# EAGLE design RPi RGB Matrix (EAGLE 8.2.2)
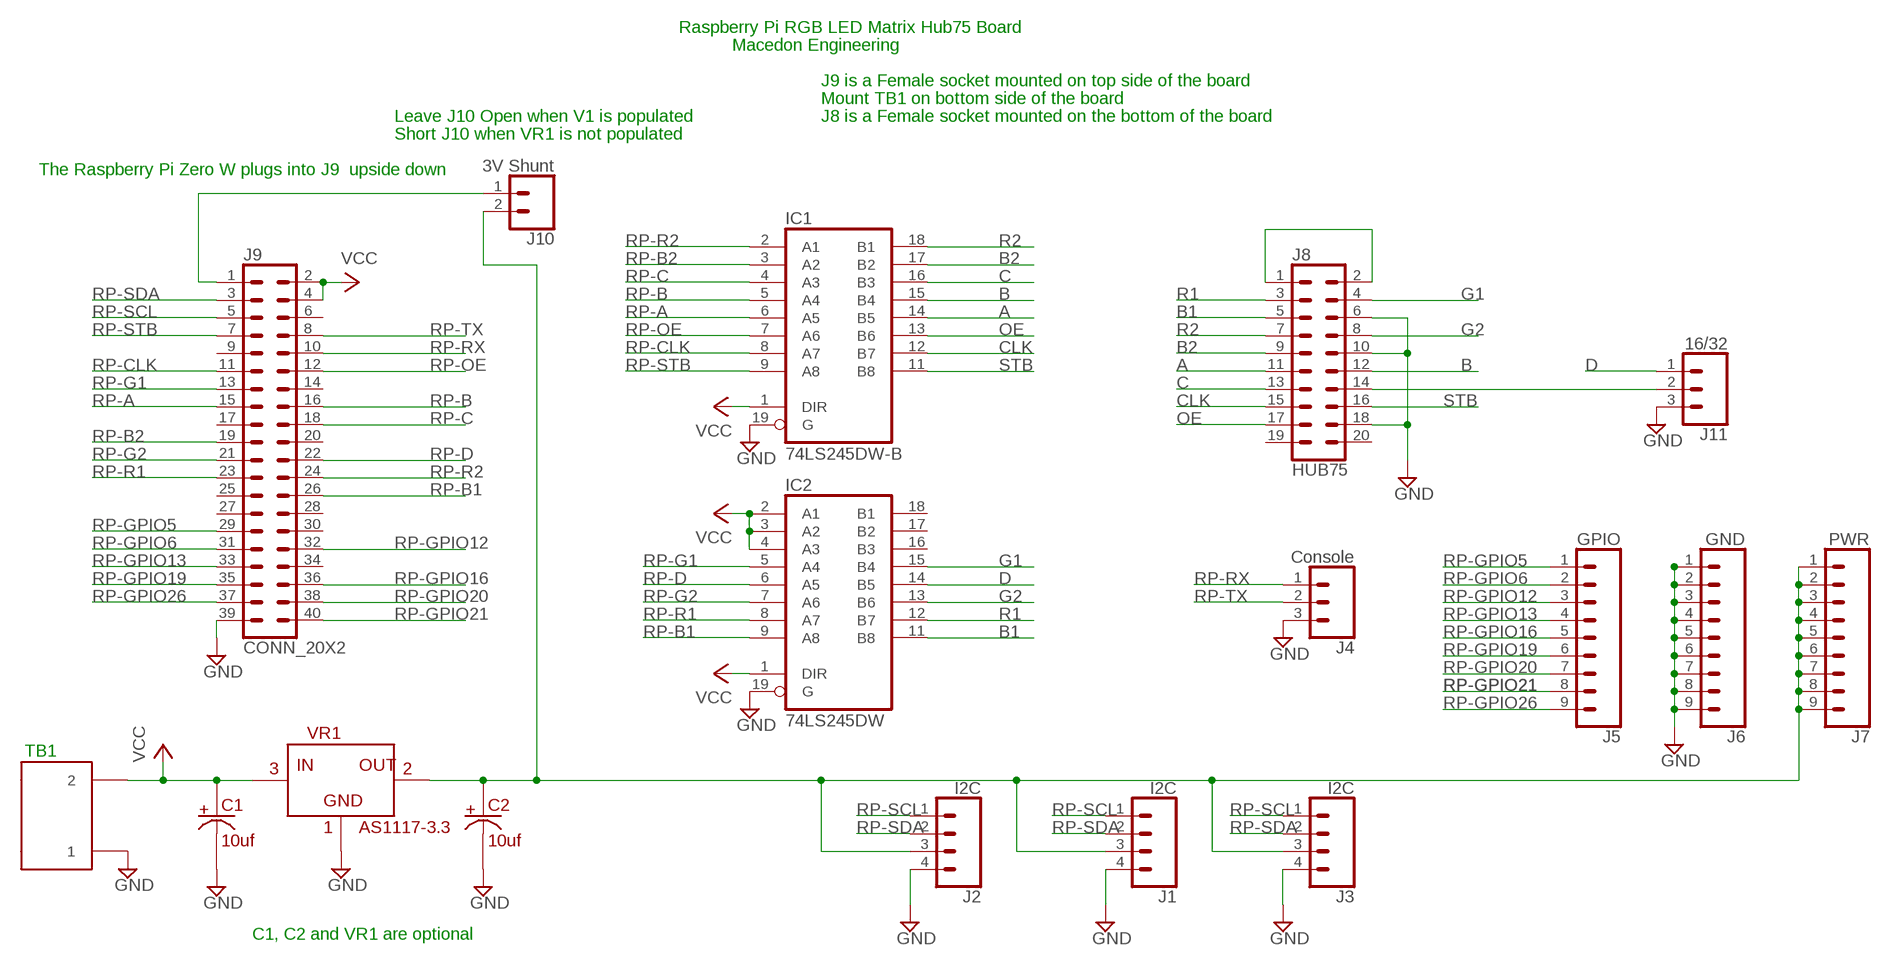
[diagram p0: schematic, sheet 1]

## Parts
C1  10uf  CAP-POL-SMT-A"  [CAP-SMT-A]
C2  10uf  CAP-POL-SMT-A"  [CAP-SMT-A]
IC1  74LS245DW-B  [SO20W-B]
IC2  74LS245DW  [SO20W]
J1  I2C  CONN_04  [1X04]
J2  I2C  CONN_04  [1X04]
J3  I2C  CONN_04  [1X04]
J4  Console  CONN_03  [1X03]
J5  GPIO  CONN_09  [1X09]
J6  GND  CONN_09  [1X09]
J7  PWR  CONN_09  [1X09]
J8  HUB75  CONN_10X2  [2X10]
J9  CONN_20X2  [2X20]
J10  3V Shunt  CONN_02  [1X02]
J11  16/32  CONN_03  [1X03]
TB1  TERMINALBLOCK-5MM-2POS  [TERMINALBLOCK-5MM-2POS]
VR1  AS1117-3.3  AS1117  [SOT-223]

## Nets
A: IC1.14(B5) J8.11
B: IC1.15(B4) J8.12
B1: IC2.11(B8) J8.5
B2: IC1.17(B2) J8.9
C: IC1.16(B3) J8.13
CLK: IC1.12(B7) J8.15
D: IC2.14(B5) J11.1
G1: IC2.15(B4) J8.4
G2: IC2.13(B6) J8.8
GND: C1.P$2 C2.P$2 IC1.19(G) IC2.19(G) J1.4 J2.4 J3.4 J4.3 J6.1 J6.2 J6.3 J6.4 J6.5 J6.6 J6.7 J6.8 J6.9 J8.6 J8.10 J8.18 J9.39 J11.3 TB1.P$1 TB1.P$4 VR1.P$1
N$1: J8.1 J8.2
N$2: J9.1 J10.1
N$4: C2.P$1 J1.3 J2.3 J3.3 J7.1 J7.2 J7.3 J7.4 J7.5 J7.6 J7.7 J7.8 J7.9 J10.2 VR1.P$2 VR1.P$4
N$5: J8.14 J11.2
OE: IC1.13(B6) J8.17
R1: IC2.12(B7) J8.3
R2: IC1.18(B1) J8.7
RP-A: IC1.6(A5) J9.15
RP-B: IC1.5(A4) J9.16
RP-B1: IC2.9(A8) J9.26
RP-B2: IC1.3(A2) J9.19
RP-C: IC1.4(A3) J9.18
RP-CLK: IC1.8(A7) J9.11
RP-D: IC2.6(A5) J9.22
RP-G1: IC2.5(A4) J9.13
RP-G2: IC2.7(A6) J9.21
RP-GPIO5: J5.1 J9.29
RP-GPIO6: J5.2 J9.31
RP-GPIO12: J5.3 J9.32
RP-GPIO13: J5.4 J9.33
RP-GPIO16: J5.5 J9.36
RP-GPIO19: J5.6 J9.35
RP-GPIO20: J5.7 J9.38
RP-GPIO21: J5.8 J9.40
RP-GPIO26: J5.9 J9.37
RP-OE: IC1.7(A6) J9.12
RP-R1: IC2.8(A7) J9.23
RP-R2: IC1.2(A1) J9.24
RP-RX: J4.1 J9.10
RP-SCL: J1.1 J2.1 J3.1 J9.5
RP-SDA: J1.2 J2.2 J3.2 J9.3
RP-STB: IC1.9(A8) J9.7
RP-TX: J4.2 J9.8
STB: IC1.11(B8) J8.16
VCC: C1.P$1 IC1.1(DIR) IC2.1(DIR) IC2.2(A1) IC2.3(A2) IC2.4(A3) J9.2 J9.4 TB1.P$2 TB1.P$3 VR1.P$3
Unconnected: IC2.16(B3) IC2.17(B2) IC2.18(B1) J8.19 J8.20 J9.6 J9.9 J9.14 J9.17 J9.20 J9.25 J9.27 J9.28 J9.30 J9.34

## Notes on the sheet
- Raspberry Pi RGB LED Matrix Hub75 Board
- Macedon Engineering
- J9 is a Female socket mounted on top side of the board
- Mount TB1 on bottom side of the board
- Leave J10 Open when V1 is populated | J8 is a Female socket mounted on the bottom of the board
- Short J10 when VR1 is not populated
- The Raspberry Pi Zero W plugs into J9  upside down
- TB1
- C1, C2 and VR1 are optional

## Power pins joined to a net without a drawn wire
GND: IC1.10(GND) IC2.10(GND)
VCC: IC1.20(VCC) IC2.20(VCC)

## Library data of the parts
C1 C2 = me:CAP-POL-SMT-A
IC1 = me:74*245: Octal BUS TRANSCEIVER, 3-state
IC2 = adafruit:74*245: Octal BUS TRANSCEIVER, 3-state
J1-J3 = SparkFun-Connectors:CONN_04: Multi connection point. Often used as Generic Header-pin footprint for 0.1 inch spaced/style header connections On any of the 0.1 inch spaced packages, you can populate with these: Break Away Headers - Straight <https://www.sparkfun.com/products/116> (PRT-00116) Break Away Male Headers - Right Angle <https://www.sparkfun.com/products/553> (PRT-00553) Female Headers <https://www.sparkfun.com/products/115> (PRT-00115) Break Away Headers - Machine Pin <https://www.sparkfun.com/products/117> (PRT-00117) Break Away Female Headers - Swiss Machine Pin <https://www.sparkfun.com/products/743> (PRT-00743) For SCREWTERMINALS and SPRING TERMINALS visit here: Screw Terimnals on SparkFun.com <https://www.sparkfun.com/search/results?term=Screw+Terminals> (5mm/3.5mm/2.54mm spacing) This device is also useful as a general connection point to wire up your design to another part of your project. Our various solder wires solder well into these plated through hole pads. Hook-Up Wire - Assortment (Stranded, 22 AWG) <https://www.sparkfun.com/products/11375> (PRT-11375) Hook-Up Wire - Assortment (Solid Core, 22 AWG) <https://www.sparkfun.com/products/11367> (PRT-11367) View the entire wire category on our website here <https://www.sparkfun.com/categories/141> Special notes: Molex polarized connector foot print use with SKU : PRT-08231 with associated crimp pins and housings. 1MM SMD Version SKU: PRT-10208; PROD_ID: CONN-09696
J4 J11 = SparkFun-Connectors:CONN_03: Multi connection point. Often used as Generic Header-pin footprint for 0.1 inch spaced/style header connections On any of the 0.1 inch spaced packages, you can populate with these: Break Away Headers - Straight <https://www.sparkfun.com/products/116> (PRT-00116) Break Away Male Headers - Right Angle <https://www.sparkfun.com/products/553> (PRT-00553) Female Headers <https://www.sparkfun.com/products/115> (PRT-00115) Break Away Headers - Machine Pin <https://www.sparkfun.com/products/117> (PRT-00117) Break Away Female Headers - Swiss Machine Pin <https://www.sparkfun.com/products/743> (PRT-00743) Stackable Header - 3 Pin (Female, 0.1") <https://www.sparkfun.com/products/13875> (PRT-13875) For SCREWTERMINALS and SPRING TERMINALS visit here: Screw Terimnals on SparkFun.com <https://www.sparkfun.com/search/results?term=Screw+Terminals> (5mm/3.5mm/2.54mm spacing) This device is also useful as a general connection point to wire up your design to another part of your project. Our various solder wires solder well into these plated through hole pads. Hook-Up Wire - Assortment (Stranded, 22 AWG) <https://www.sparkfun.com/products/11375> (PRT-11375) Hook-Up Wire - Assortment (Solid Core, 22 AWG) <https://www.sparkfun.com/products/11367> (PRT-11367) View the entire wire category on our website here <https://www.sparkfun.com/categories/141> Special notes: Molex polarized connector foot print use with SKU : PRT-08232 with associated crimp pins and housings.
J5-J7 = SparkFun-Connectors:CONN_09: Multi connection point. Often used as Generic Header-pin footprint for 0.1 inch spaced/style header connections On any of the 0.1 inch spaced packages, you can populate with these: Break Away Headers - Straight <https://www.sparkfun.com/products/116> (PRT-00116) Break Away Male Headers - Right Angle <https://www.sparkfun.com/products/553> (PRT-00553) Female Headers <https://www.sparkfun.com/products/115> (PRT-00115) Break Away Headers - Machine Pin <https://www.sparkfun.com/products/117> (PRT-00117) Break Away Female Headers - Swiss Machine Pin <https://www.sparkfun.com/products/743> (PRT-00743) For SCREWTERMINALS and SPRING TERMINALS visit here: Screw Terimnals on SparkFun.com <https://www.sparkfun.com/search/results?term=Screw+Terminals> (5mm/3.5mm/2.54mm spacing) This device is also useful as a general connection point to wire up your design to another part of your project. Our various solder wires solder well into these plated through hole pads. Hook-Up Wire - Assortment (Stranded, 22 AWG) <https://www.sparkfun.com/products/11375> (PRT-11375) Hook-Up Wire - Assortment (Solid Core, 22 AWG) <https://www.sparkfun.com/products/11367> (PRT-11367) View the entire wire category on our website here <https://www.sparkfun.com/categories/141> Special notes: Molex polarized connector foot print use with SKU : PRT-08231 with associated crimp pins and housings. 1MM SMD Version SKU: PRT-10208 NOTES ON THE VARIANTS LOCK and LOCK_LONGPADS... This footprint was designed to help hold the alignment of a through-hole component (i.e. 6-pin header) while soldering it into place. You may notice that each hole has been shifted either up or down by 0.005 of an inch from it's more standard position (which is a perfectly straight line). This slight alteration caused the pins (the squares in the middle) to touch the edges of the holes. Because they are alternating, it causes a "brace" to hold the component in place. 0.005 has proven to be the perfect amount of "off-center" position when using our standard breakaway headers. Although looks a little odd when you look at the bare footprint, once you have a header in there, the alteration is very hard to notice. Also,if you push a header all the way into place, it is covered up entirely on the bottom side.
J8 = SparkFun-Connectors:CONN_10X2: Multi connection point. Often used as Generic Header-pin footprint for 0.1 inch spaced/style header connections On any of the 0.1 inch spaced packages, you can populate with these: Break Away Headers - Straight <https://www.sparkfun.com/products/116> (PRT-00116) Break Away Male Headers - Right Angle <https://www.sparkfun.com/products/553> (PRT-00553) Female Headers <https://www.sparkfun.com/products/115> (PRT-00115) Break Away Headers - Machine Pin <https://www.sparkfun.com/products/117> (PRT-00117) Break Away Female Headers - Swiss Machine Pin <https://www.sparkfun.com/products/743> (PRT-00743) Special note about the "SPECIAL" package: This was SPECIALLY designed to be used with our Graphic LCD Backpack. Be sure you want to use this! It is not only staggered on each line of header holes, but IT IS ALSO offset of the center point of the top and bottom lines by 5 mil. This causes the headers to lock into place on the "standard" footprint on the LCD screen. The extra squares on the tdocu layer are there simply to reference other pins (if you were to actually populate a longer header than ten long - this is what we do with the backpacks).
J9 = SparkFun-Connectors:CONN_20X2: Multi connection point. Often used as Generic Header-pin footprint for 0.1 inch spaced/style header connections On any of the 0.1 inch spaced packages, you can populate with these: Break Away Headers - Straight <https://www.sparkfun.com/products/116> (PRT-00116) Break Away Male Headers - Right Angle <https://www.sparkfun.com/products/553> (PRT-00553) Female Headers <https://www.sparkfun.com/products/115> (PRT-00115) Break Away Headers - Machine Pin <https://www.sparkfun.com/products/117> (PRT-00117) Break Away Female Headers - Swiss Machine Pin <https://www.sparkfun.com/products/743> (PRT-00743)
J10 = SparkFun-Connectors:CONN_02: Multi connection point. Often used as Generic Header-pin footprint for 0.1 inch spaced/style header connections On any of the 0.1 inch spaced packages, you can populate with these: Break Away Headers - Straight <https://www.sparkfun.com/products/116> (PRT-00116) Break Away Male Headers - Right Angle <https://www.sparkfun.com/products/553> (PRT-00553) Female Headers <https://www.sparkfun.com/products/115> (PRT-00115) Break Away Headers - Machine Pin <https://www.sparkfun.com/products/117> (PRT-00117) Break Away Female Headers - Swiss Machine Pin <https://www.sparkfun.com/products/743> (PRT-00743) For SCREWTERMINALS and SPRING TERMINALS visit here: Screw Terimnals on SparkFun.com <https://www.sparkfun.com/search/results?term=Screw+Terminals> (5mm/3.5mm/2.54mm spacing) This device is also useful as a general connection point to wire up your design to another part of your project. Our various solder wires solder well into these plated through hole pads. Hook-Up Wire - Assortment (Stranded, 22 AWG) <https://www.sparkfun.com/products/11375> (PRT-11375) Hook-Up Wire - Assortment (Solid Core, 22 AWG) <https://www.sparkfun.com/products/11367> (PRT-11367) View the entire wire category on our website here <https://www.sparkfun.com/categories/141> Special notes: Molex polarized connector foot print use with: PRT-08233 with associated crimp pins and housings. 2.54_SCREWTERM for use with PRT-10571. 3.5mm Screw Terminal footprints for PRT-08084 5mm Screw Terminal footprints for use with PRT-08432
TB1 = me:TERMINALBLOCK-5MM-2POS
VR1 = me:AS1117

## Board
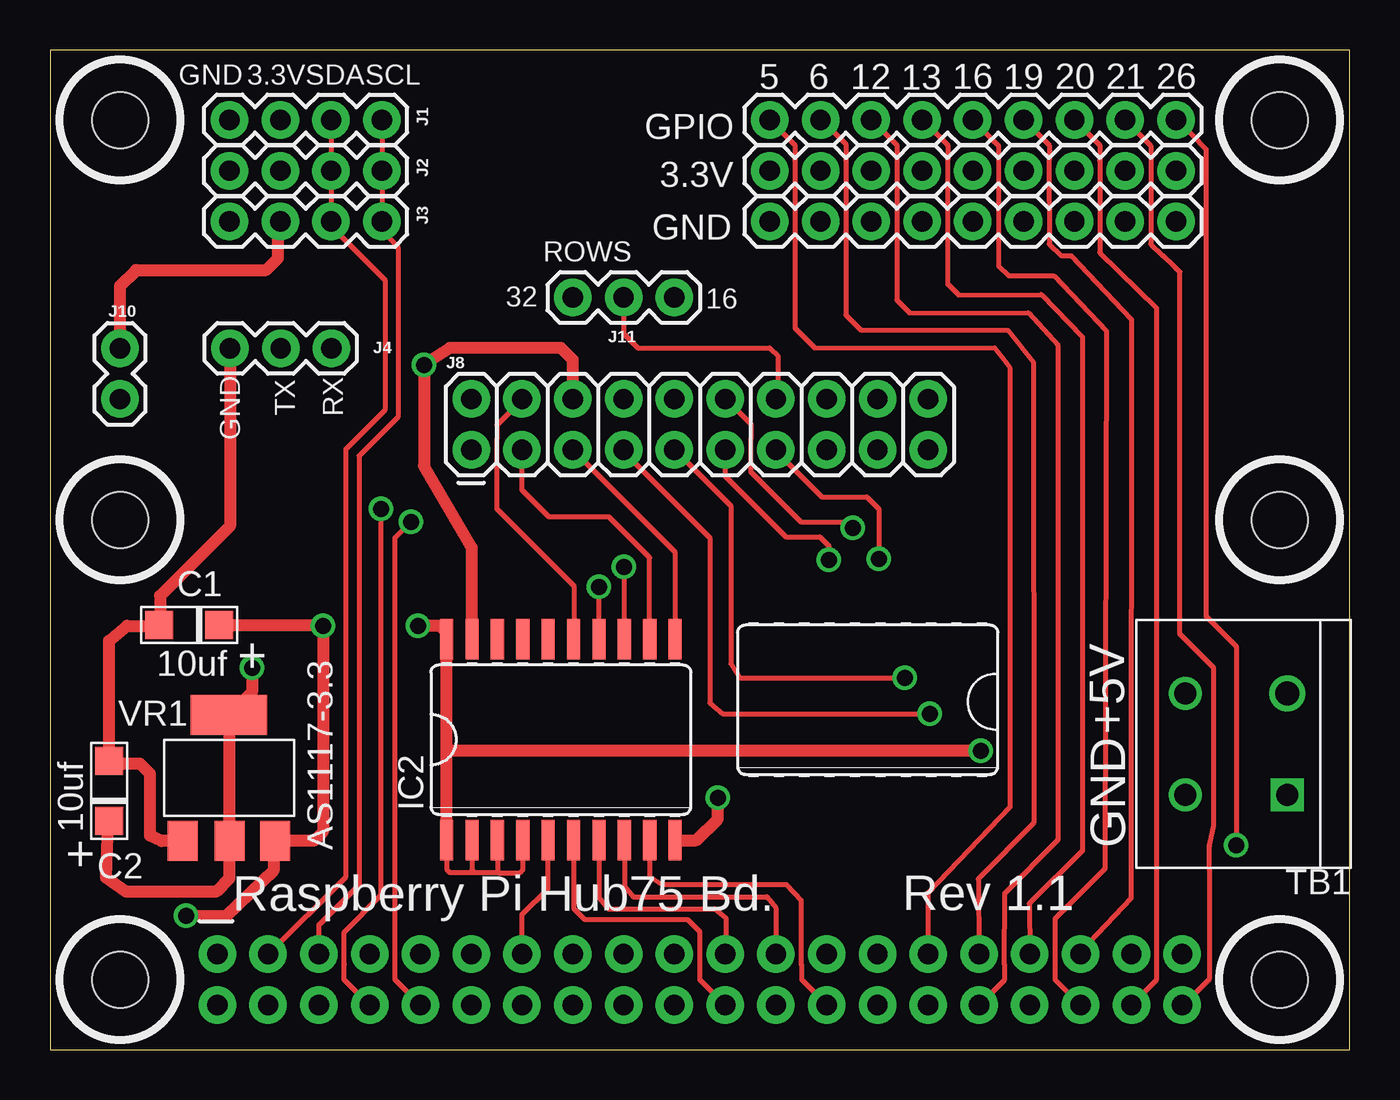
[diagram p1: board, top side]
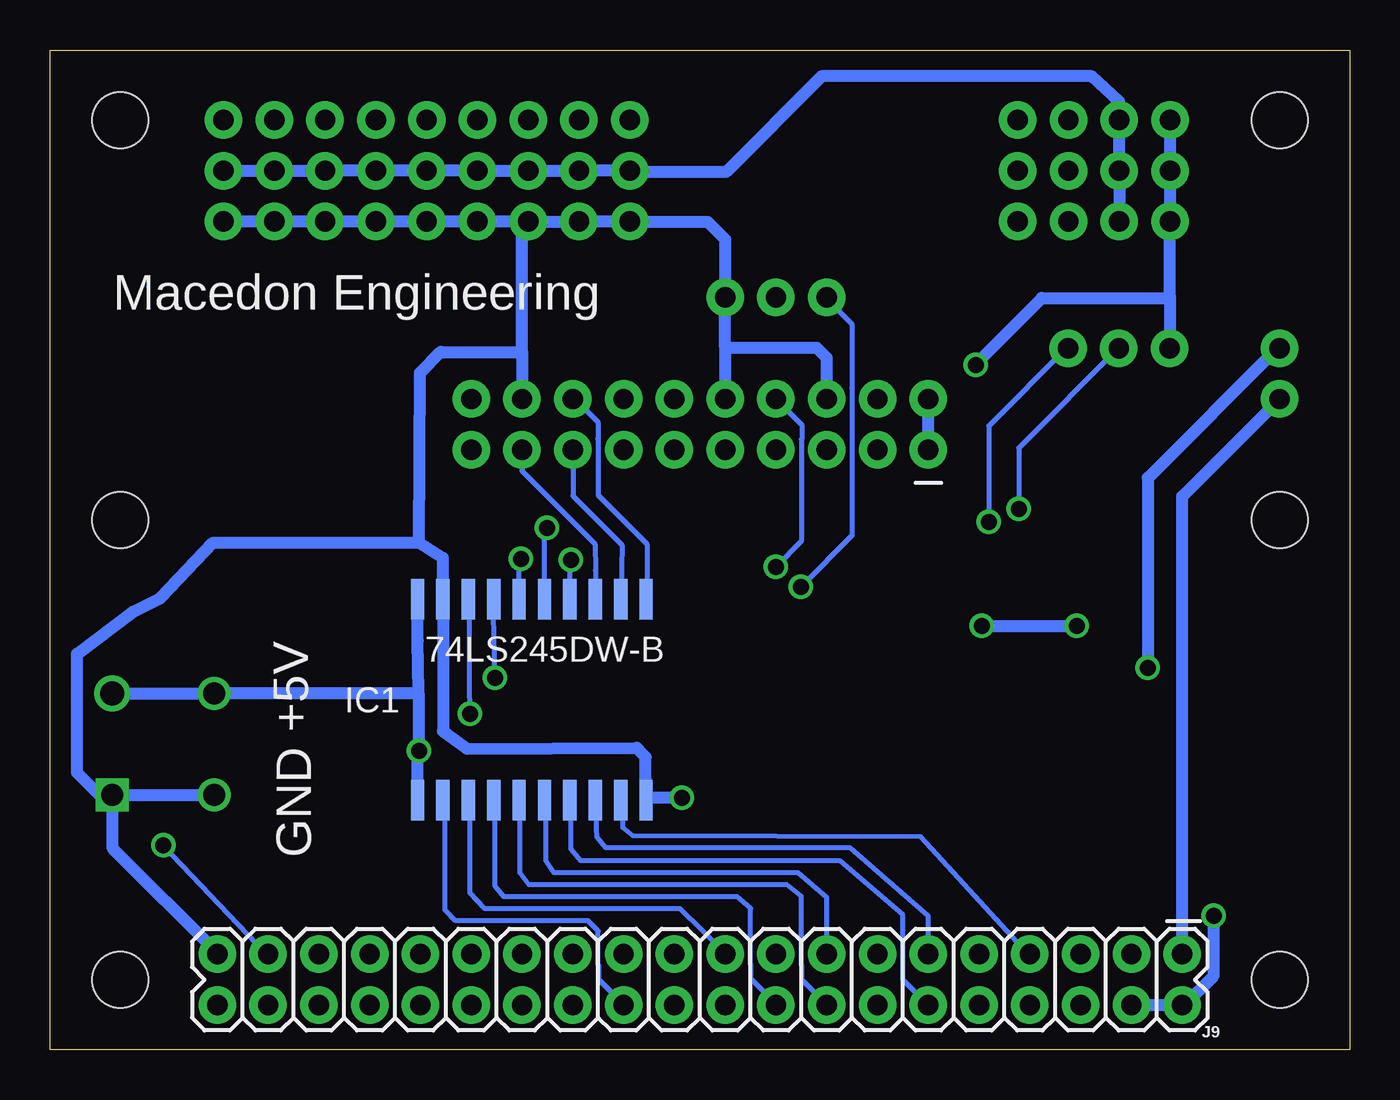
[diagram p2: board, bottom side, seen from below]

Size 65 x 50 mm. Coordinates in mm from the lower left corner, seen from the top.
Outline: 0,0 65,0 65,50 0,50 0,0
Copper layers (1*16): Top 0.035mm / dielectric 1.5mm / Bottom 0.035mm
Design rules "default": minimum track width 10mil, minimum drill 24mil, track to track 8mil, track to pad 8mil, pad to pad 8mil, via to via 8mil, smd to smd 8mil, copper to edge 40mil, drill to drill 8mil, minimum pad ring 10mil, minimum via ring 8mil, stop-mask expansion 4mil, vias tented up to drill 0mil, thermal gap 10mil
Holes 2.8 mm at 3.5,46.5 3.5,3.5 61.5,3.5 3.5,26.5 61.5,26.5 61.5,46.5

### Footprints (pad centres in the part's own frame; a part is rotated, then mirrored left to right if it is on the bottom)
CAP-SMT-A = smd 1.4 x 1.4: P$1 -1.5,0; P$2 1.5,0
SO20W-B = smd 0.66 x 2.032 bottom: 1 5.715,-5.029; 2 4.445,-5.029; 3 3.175,-5.029; 4 1.905,-5.029; 5 0.635,-5.029; 6 -0.635,-5.029; 7 -1.905,-5.029; 8 -3.175,-5.029; 9 -4.445,-5.029; 10 -5.715,-5.029; 11 -5.715,5.029; 12 -4.445,5.029; 13 -3.175,5.029; 14 -1.905,5.029; 15 -0.635,5.029; 16 0.635,5.029; 17 1.905,5.029; 18 3.175,5.029; 19 4.445,5.029; 20 5.715,5.029
SO20W = smd 0.66 x 2.032: 1 -5.715,-5.029; 2 -4.445,-5.029; 3 -3.175,-5.029; 4 -1.905,-5.029; 5 -0.635,-5.029; 6 0.635,-5.029; 7 1.905,-5.029; 8 3.175,-5.029; 9 4.445,-5.029; 10 5.715,-5.029; 11 5.715,5.029; 12 4.445,5.029; 13 3.175,5.029; 14 1.905,5.029; 15 0.635,5.029; 16 -0.635,5.029; 17 -1.905,5.029; 18 -3.175,5.029; 19 -4.445,5.029; 20 -5.715,5.029
1X04 = drill 1.016 pad 1.88: 1 0,0; 2 2.54,0; 3 5.08,0; 4 7.62,0
1X03 = drill 1.016 pad 1.88: 1 0,0; 2 2.54,0; 3 5.08,0
1X09 = drill 1.016 pad 1.88: 1 0,0; 2 2.54,0; 3 5.08,0; 4 7.62,0; 5 10.16,0; 6 12.7,0; 7 15.24,0; 8 17.78,0; 9 20.32,0
2X10 = drill 1.016 pad 1.88: 1 0,0; 2 0,2.54; 3 2.54,0; 4 2.54,2.54; 5 5.08,0; 6 5.08,2.54; 7 7.62,0; 8 7.62,2.54; 9 10.16,0; 10 10.16,2.54; 11 12.7,0; 12 12.7,2.54; 13 15.24,0; 14 15.24,2.54; 15 17.78,0; 16 17.78,2.54; 17 20.32,0; 18 20.32,2.54; 19 22.86,0; 20 22.86,2.54
2X20 = drill 1.016 pad 1.88: 1 0,0; 2 0,2.54; 3 2.54,0; 4 2.54,2.54; 5 5.08,0; 6 5.08,2.54; 7 7.62,0; 8 7.62,2.54; 9 10.16,0; 10 10.16,2.54; 11 12.7,0; 12 12.7,2.54; 13 15.24,0; 14 15.24,2.54; 15 17.78,0; 16 17.78,2.54; 17 20.32,0; 18 20.32,2.54; 19 22.86,0; 20 22.86,2.54; 21 25.4,0; 22 25.4,2.54; 23 27.94,0; 24 27.94,2.54; 25 30.48,0; 26 30.48,2.54; 27 33.02,0; 28 33.02,2.54; 29 35.56,0; 30 35.56,2.54; 31 38.1,0; 32 38.1,2.54; 33 40.64,0; 34 40.64,2.54; 35 43.18,0; 36 43.18,2.54; 37 45.72,0; 38 45.72,2.54; 39 48.26,0; 40 48.26,2.54
1X02 = drill 1.016 pad 1.88: 1 0,0; 2 2.54,0
TERMINALBLOCK-5MM-2POS = drill 1.1 square: P$1 -2.54,2.54 | drill 1.2: P$2 -2.54,-2.54 | drill 1.1: P$3 2.54,-2.54; P$4 2.54,2.54
SOT-223 = smd 1.5 x 2: P$1 -2.3,-3.15; P$2 0.03,-3.15; P$3 2.3,-3.15 | smd 3.8 x 2: P$4 0,3.15

### Placement (x,y rotation side)
C1  6.97,21.23 180 top
C2  2.95,12.93 90 top
IC1  40.9,17.5 0 top
IC2  25.55,15.5 0 top
J1  16.6,46.5 180 top
J2  16.6,43.96 180 top
J3  16.6,41.42 180 top
J4  14.08,35.08 180 top
J5  36,46.5 0 top
J6  36,41.42 0 top
J7  36,43.96 0 top
J8  21.07,30 0 top
J9  8.37,4.77 180 bottom
J10  3.5,32.54 90 top
J11  26.15,37.62 0 top
TB1  59.34,15.29 180 top
VR1  8.95,13.58 0 top

### Tracks (layer width: path | path; a pad name or v marks a point on that pad's centre or on a via)
A  (via drill 0.8)
  Top 0.254: J8.11 33.77,28.68 36.8,25.65 38.5,25.65 38.95,25.2 v38.95,24.5
  Bottom 0.254: v38.95,24.5 38.99,24.45 IC1.14
B  (via drill 0.8)
  Top 0.254: J8.12 33.81,32.54 35.05,31.3 35.05,30.54 35.04,30.53 35.04,28.91 37.55,26.4 39.85,26.4 v40.15,26.1 40.16,26.09
  Bottom 0.254: IC1.15 40.27,25.98 v40.15,26.1
B1
  Top 0.254: J8.5 31.25,24.9 31.25,21.17 IC2.11
B2  (via drill 0.8)
  Top 0.254: J8.9 31.25,30 34.05,27.2 34.05,19.3 34.5,18.6 v42.75,18.6
  Bottom 0.254: 42.76,19.16 v42.75,18.6 42.81,21.74 IC1.17
C  (via drill 0.8)
  Top 0.254: J8.13 36.31,29.94 38.6,27.65 40.85,27.65 41.45,27.05 v41.45,24.55
  Bottom 0.254: IC1.16 41.53,24.46 v41.45,24.55
CLK
  Bottom 0.254: J8.15 38.85,27.7 36.4,25.25 36.41,24.05 36.41,22.57 IC1.12
D  (via drill 0.8)
  Top 0.254: IC2.14 v27.46,23.14 v27.45,23.15
  Bottom 0.254: J11.1 26.15,37.55 24.9,36.3 24.9,33.09 24.88,33.07 24.88,25.72 v27.45,23.15
G1
  Top 0.254: J8.4 23.61,32.51 22.35,31.25 22.35,30.54 22.34,30.53 22.34,27.06 26.2,23.2 26.2,21.17 IC2.15
G2  (via drill 0.8)
  Top 0.254: IC2.13 28.73,24.12 v28.7,24.15
  Bottom 0.254: J8.8 27.4,31.25 27.4,30.55 27.42,30.53 27.42,25.43 v28.7,24.15
GND  (via drill 0.8)
  Top 0.61: VR1.P$1 5.57,10.43 5,10.7 5,13.8 4.5,14.3 3.58,14.3 C2.P$2 2.95,20.45 3.85,21.2 5.35,21.2 C1.P$2 5.5,21.27 5.5,22.7 9,26.2 J4.3 | IC2.19 21.11,25.09 18.7,29.2 v18.7,34.25 18.75,34.3 20,35.1 25.55,35.1 26.15,34.5 J8.6 | IC2.10 32.32,10.47 33.4,11.55 v33.4,12.6
  Bottom 0.254: J9.39
  Bottom 0.61: J6.3 J6.2 J6.1 35.98,41.4 32.1,41.4 31.23,40.53 J11.3 31.23,35.13 | J6.3 J6.4 J6.5 J6.6 J6.7 J6.8 J6.9 | 41.39,34.94 J8.18 | 41.39,34.94 41.39,41.11 J6.3 | J1.4 J2.4 J3.4 8.98,37.68 | 8.98,37.4 8.98,34.82 J4.3 | 8.98,37.68 8.98,37.4 | 31.23,35.13 J8.10 | TB1.P$1 TB1.P$4 | TB1.P$1 62.55,12.74 63.65,13.85 63.65,19.8 60.85,21.9 59.45,22.6 56.84,25.36 46.54,25.36 | 46.54,25.36 45.36,24.61 45.36,22.55 IC1.19 45.34,15.92 44.15,15.05 35.65,15.1 35.21,14.62 35.21,13.51 35.21,12.6 35.06,12.6 | J9.39 56.63,4.83 61.85,10.05 61.85,12.72 TB1.P$1 | J8.6 26.15,34.6 26.65,35.1 31.2,35.1 31.23,35.13 | 46.54,25.36 46.5,33.85 45.45,34.9 41.43,34.9 41.39,34.94 | 8.98,37.4 | v18.7,34.25 18.7,34.3 15.4,37.6 9.06,37.6 8.98,37.68 | v33.4,12.6 35.06,12.6 | 35.06,12.6 IC1.10
N$1
  Bottom 0.61: J8.1 J8.2
N$2
  Bottom 0.61: J9.1 8.37,27.67 J10.1
N$4  (via drill 0.8)
  Top 0.61: C2.P$1 2.9,11.38 2.8,8.6 3.8,7.9 8.3,7.9 8.98,8.58 VR1.P$2 8.98,16.7 VR1.P$4 10.1,17.88 v10.1,19.1 | J10.2 3.5,38.2 4.3,39 10.8,39 11.4,39.6 11.4,41.3 J3.3
  Bottom 0.61: J7.9 J7.8 J7.7 J7.6 J7.5 J7.4 J7.3 J7.2 J7.1 35.94,43.9 31.2,43.9 26.42,48.68 12.88,48.68 11.52,47.42 J1.3 J2.3 J3.3 | J10.2 3.62,35.08 10.1,28.6 v10.1,19.1
N$5
  Top 0.254: J11.2 28.69,35.81 29.4,35.1 36,35.1 36.4,34.7 36.4,32.63 J8.14
OE
  Bottom 0.254: J8.17 41.39,28.94 37.75,25.3 37.73,23.98 IC1.13
R1
  Top 0.254: J8.3 23.61,28 24.95,26.65 27.95,26.65 30,24.6 IC2.12
R2  (via drill 0.8)
  Top 0.254: J8.7 28.69,29.91 33,25.6 33,17.35 33.65,16.8 v44,16.8
  Bottom 0.254: v44,16.8 44.02,18.38 44.02,22.48 IC1.18
RP-A
  Bottom 0.254: J9.15 26.15,7.6 27.6,8.85 39.8,8.85 40.2,9.45 40.2,12.41 IC1.6
RP-B
  Bottom 0.254: J9.16 26.15,2.25 27.4,3.5 27.4,4.22 27.42,4.24 27.42,7.67 28.15,8.25 41.05,8.25 41.5,8.85 41.5,12.44 IC1.5
RP-B1
  Top 0.254: J9.26 38.85,2.25 37.6,3.5 37.6,4.22 37.58,4.24 37.58,7.47 36.85,8.25 30.6,8.25 30,8.65 30,11.09 IC2.9
RP-B2
  Bottom 0.254: J9.19 31.23,4.83 33.5,7.05 43.25,7.05 44,7.85 44,12.4 IC1.3
RP-C
  Bottom 0.254: J9.18 28.69,2.29 29.95,3.55 29.95,4.23 29.96,4.24 29.96,7.06 30.65,7.65 42.3,7.65 42.75,8.2 42.75,12.42 IC1.4
RP-CLK
  Bottom 0.254: J9.11 21.07,6.67 25,10.1 37.2,10.1 37.65,10.65 37.67,11.07 37.67,12.42 IC1.8
RP-D
  Top 0.254: J9.22 32.5,3.5 32.5,5.9 31.9,6.5 26.75,6.5 26.2,7.05 26.2,11.08 IC2.6
RP-G1
  Top 0.254: J9.13 23.61,6.76 24.9,8.05 24.9,11.08 IC2.5
RP-G2
  Top 0.254: IC2.7 27.46,7.59 27.9,7.05 33.25,7.05 33.8,6.6 33.8,4.8 J9.21
RP-GPIO5
  Top 0.254: J5.1 37.25,45.25 37.25,44.51 37.27,44.49 37.27,36.08 38.25,35.1 47.24,35.11 47.73,34.5 48.02,34.09 48.02,12.14 43.93,7.83 J9.29
RP-GPIO6
  Top 0.254: J5.2 38.6,46.5 39.8,45.3 39.8,44.5 39.81,44.49 39.81,40.89 39.8,40.88 39.8,36.75 40.55,36 47.91,35.99 49.17,34.4 49.2,11.35 46.42,8.54 46.45,4.79 J9.31
RP-GPIO12
  Top 0.254: J5.3 41.1,46.5 42.35,45.25 42.35,37.5 43,36.85 48.92,36.86 50.42,35.21 50.42,10.51 47.75,7.82 47.74,4.24 47.75,4.23 47.75,3.5 J9.32
RP-GPIO13
  Top 0.254: J5.4 43.65,46.5 44.9,45.25 44.9,44.5 44.89,44.49 44.89,38.31 45.45,37.75 49.58,37.76 51.64,35.64 51.64,9.94 48.98,7.31 J9.33
RP-GPIO16
  Top 0.152: J5.5 | J9.36 51.52,2.23
  Top 0.254: J5.5 47.44,45.2 47.44,39.2 47.95,38.7 50.2,38.7 52.85,35.91 52.77,9.06 50.27,6.56 50.27,3.5 51.52,2.23
RP-GPIO19
  Top 0.254: J5.6 49.98,45.23 49.98,44.48 49.97,44.49 49.98,40.29 50.59,39.71 51.09,39.71 54.1,36.52 54.08,7.58 51.55,4.9 J9.35
RP-GPIO20
  Top 0.254: J5.7 52.5,45.25 52.5,44.5 52.51,44.49 52.51,39.87 55.36,37.1 55.36,4.24 55.35,4.23 55.35,3.5 J9.38
RP-GPIO21
  Top 0.254: J5.8 53.78,46.47 55.05,45.2 55.05,40.3 55.65,39.7 56.25,39.14 56.51,38.89 56.51,20.79 58.2,19.1 58.2,11.18 57.99,10.17 57.99,9.06 58,8.98 58,3.55 56.68,2.23 J9.40
RP-GPIO26  (via drill 0.8)
  Top 0.254: J5.9 56.4,46.5 57.81,45.05 57.81,21.69 59.34,20.16 v59.33,10.22
  Bottom 0.254: J9.37 54.17,4.77 v59.33,10.22
RP-OE
  Bottom 0.254: J9.12 22.35,3.5 22.35,4.23 22.34,4.24 22.34,6.74 25.5,9.45 38.45,9.45 38.95,10.05 38.95,12.43 IC1.7
RP-R1
  Top 0.254: IC2.8 28.73,8.17 29.15,7.65 35.85,7.65 36.3,7.1 J9.23
RP-R2
  Bottom 0.254: J9.24 36.31,2.26 37.55,3.5 37.55,4.21 37.58,4.24 37.58,5.93 38.1,6.45 44.7,6.45 45.25,7 45.25,12.38 IC1.2
RP-RX  (via drill 0.8)
  Top 0.254: J9.10 17.25,3.5 17.25,4.23 17.26,4.24 17.26,25.61 v18.05,26.4
  Bottom 0.254: J4.1 14.17,35.08 18.05,31.2 v18.05,26.4
RP-SCL
  Top 0.254: J9.5 13.45,6.25 15.45,8.25 15.45,29.7 17.4,31.65 17.4,40.15 16.6,40.95 J3.1 J2.1 J1.1
RP-SDA
  Top 0.254: J1.2 J2.2 J3.2 14.06,41.19 16.75,38.5 16.75,32 14.8,30.05 14.8,8.65 J9.3
RP-STB
  Bottom 0.254: J9.7 16.07,4.77 21.45,10.65 35.85,10.7 36.35,11.1 | 36.35,11.1 36.33,11.1 | 36.35,11.1 36.35,12.37 IC1.9
RP-TX  (via drill 0.8)
  Top 0.254: J9.8 15.97,2.23 14.7,3.5 14.7,4.22 14.72,4.24 14.72,5.87 16.55,7.75 v16.55,27.05
  Bottom 0.254: J4.2 11.57,35.08 16.55,30.1 v16.55,27.05
STB
  Bottom 0.254: J8.16 38.74,32.54 37.6,31.4 37.6,30.55 37.58,30.53 37.58,27.73 35.15,25.3 35.15,22.56 IC1.11
VCC  (via drill 0.8)
  Top 0.254: IC2.4 23.65,9 23.5,8.85 22.42,8.85 | 22.42,8.85 21.24,8.85 | 21.24,8.85 20,8.85 19.85,9 19.85,10.46 IC2.1 | IC2.2 21.11,8.98 21.24,8.85 | IC2.3 22.38,8.9 22.42,8.85
  Top 0.61: v6.8,6.7 8.8,6.7 11.2,9 11.2,10.38 VR1.P$3 11.27,10.45 13.2,10.45 13.65,10.9 v13.65,21.2 13.62,21.23 C1.P$1 | 19.84,14.98 IC2.20 19.84,20.86 19.5,21.2 v18.4,21.2 | IC2.1 19.84,14.98 | 19.84,14.98 19.86,14.95 v46.55,14.95
  Bottom 0.61: TB1.P$2 TB1.P$3 46.62,17.82 | J9.4 J9.2 8.27,2.23 6.8,3.7 v6.8,6.7 | 46.62,17.82 46.56,17.88 46.6,20.44 46.6,22.52 IC1.20 | 46.62,17.82 46.55,17.75 v46.55,14.95 46.62,14.88 IC1.1 | v18.4,21.2 v13.65,21.2

### Text on the board
tPlace: GND | 3.3V | SDA | SCL | 5 | 6 | 12 | 13 | 16 | 19 | 20 | 21 | 26 | GPIO | 3.3V | GND | ROWS | 32 | 16 | TX | RX | GND | +5V | GND | Raspberry Pi Hub75 Bd. | Rev 1.1
bPlace: Macedon Engineering | +5V | GND
tValues: Macedon Engineering